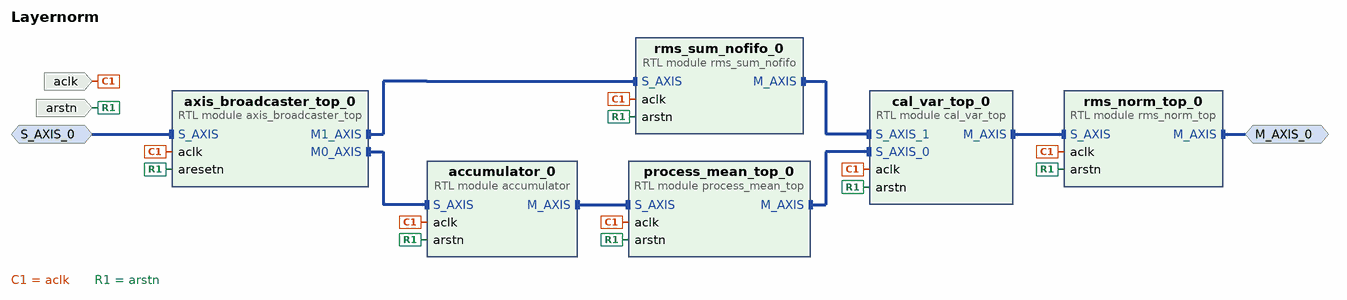
[diagram p0: block diagram of the top level]
# Vivado block design Layernorm, xc7z010iclg225-1L, Vivado 2024.2
create_bd_design Layernorm

create_bd_intf_port -mode Slave -vlnv xilinx.com:interface:axis_rtl:1.0 S_AXIS_0
set_property -dict [list \
  CONFIG.FREQ_HZ 200000000 \
  CONFIG.HAS_TKEEP 0 \
  CONFIG.HAS_TLAST 0 \
  CONFIG.HAS_TREADY 1 \
  CONFIG.HAS_TSTRB 0 \
  CONFIG.LAYERED_METADATA undef \
  CONFIG.TDATA_NUM_BYTES 16 \
  CONFIG.TDEST_WIDTH 0 \
  CONFIG.TID_WIDTH 0 \
  CONFIG.TUSER_WIDTH 0 \
] [get_bd_intf_ports S_AXIS_0]
create_bd_intf_port -mode Master -vlnv xilinx.com:interface:axis_rtl:1.0 M_AXIS_0
set_property -dict {CONFIG.FREQ_HZ 200000000} [get_bd_intf_ports M_AXIS_0]
create_bd_port -dir I -type clk aclk
set_property -dict {CONFIG.FREQ_HZ 200000000} [get_bd_ports aclk]
create_bd_port -dir I -type rst arstn

create_bd_cell -type module -reference process_mean_top process_mean_top_0
create_bd_cell -type module -reference cal_var_top cal_var_top_0
create_bd_cell -type module -reference accumulator accumulator_0
create_bd_cell -type module -reference axis_broadcaster_top axis_broadcaster_top_0
create_bd_cell -type module -reference rms_norm_top rms_norm_top_0
create_bd_cell -type module -reference rms_sum_nofifo rms_sum_nofifo_0

# ---- connections ----

connect_bd_intf_net -intf_net S_AXIS_0_1 [get_bd_intf_ports S_AXIS_0] [get_bd_intf_pins axis_broadcaster_top_0/S_AXIS]
connect_bd_intf_net [get_bd_intf_pins accumulator_0/M_AXIS] [get_bd_intf_pins process_mean_top_0/S_AXIS]
connect_bd_intf_net [get_bd_intf_pins axis_broadcaster_top_0/M0_AXIS] [get_bd_intf_pins accumulator_0/S_AXIS]
connect_bd_intf_net [get_bd_intf_pins rms_sum_nofifo_0/S_AXIS] [get_bd_intf_pins axis_broadcaster_top_0/M1_AXIS]
connect_bd_intf_net [get_bd_intf_pins cal_var_top_0/M_AXIS] [get_bd_intf_pins rms_norm_top_0/S_AXIS]
connect_bd_intf_net [get_bd_intf_pins process_mean_top_0/M_AXIS] [get_bd_intf_pins cal_var_top_0/S_AXIS_0]
connect_bd_intf_net [get_bd_intf_ports M_AXIS_0] [get_bd_intf_pins rms_norm_top_0/M_AXIS]
connect_bd_intf_net [get_bd_intf_pins rms_sum_nofifo_0/M_AXIS] [get_bd_intf_pins cal_var_top_0/S_AXIS_1]
connect_bd_net [get_bd_ports aclk] \
  [get_bd_pins accumulator_0/aclk] [get_bd_pins cal_var_top_0/aclk] [get_bd_pins axis_broadcaster_top_0/aclk] \
  [get_bd_pins rms_norm_top_0/aclk] [get_bd_pins rms_sum_nofifo_0/aclk] [get_bd_pins process_mean_top_0/aclk]
connect_bd_net -net rst_clk_wiz_100M_peripheral_aresetn [get_bd_ports arstn] \
  [get_bd_pins accumulator_0/arstn] [get_bd_pins cal_var_top_0/arstn] [get_bd_pins axis_broadcaster_top_0/aresetn] \
  [get_bd_pins rms_norm_top_0/arstn] [get_bd_pins rms_sum_nofifo_0/arstn] [get_bd_pins process_mean_top_0/arstn]

validate_bd_design
save_bd_design
